# Altium schematic sheet [04] - SIM808.SchDoc: =ProjectName
size A4; CheckedBy: Ven; Author: Ven; CompanyName: HUST; Revision: V.1.0
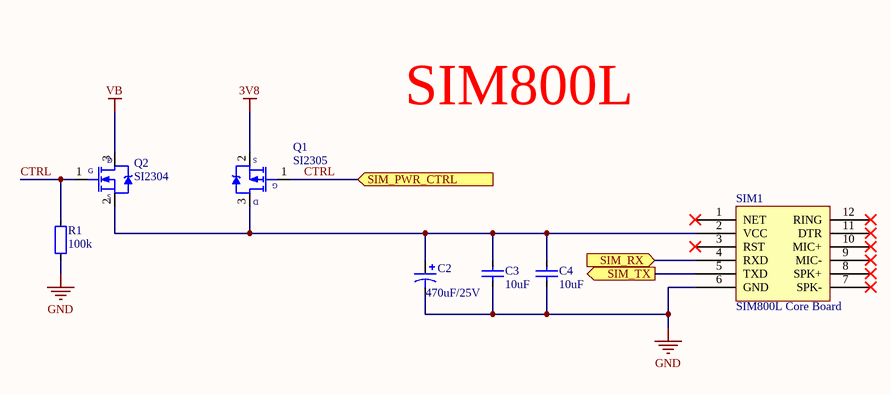
[diagram p0: [04] - SIM808.SchDoc]

## Parts
C2  470uF/25V  [C8mm]
C3  10uF  [CAP_0805]
C4  10uF  [CAP_0805]
Q1  SI2305  [SOT23]
Q2  SI2304  [SOT23]
R1  100k  [RES-SMD-0805]
SIM1  SIM800L Core Board  [SIM800L Core Board]

## Ports
SIM_PWR_CTRL (in), SIM_RX (in), SIM_TX (out)

## Nets
3V8: Q1.2(S)
GND: C2.2 C3.1 C4.1 R1.1 SIM1.6(GND)
VB: Q2.3(D)
CTRL: Q1.1(G) Q2.1(G) R1.2 ; port SIM_PWR_CTRL
SIM_RX: SIM1.4(RXD) ; port SIM_RX
SIM_TX: SIM1.5(TXD) ; port SIM_TX
NetC2_1: C2.1 C3.2 C4.2 Q1.3(D) Q2.2(S) SIM1.2(VCC)

Not connected (* = marked no-connect by the designer): SIM1 1(NET)* 3(RST)* 7(SPK-)* 8(SPK+)* 9(MIC-)* 10(MIC+)* 11(DTR)* 12(RING)*

## Notes on the sheet
- SIM800L
- Project:
- Page Contents:
- Size:
- Date:
- A4
- Checked by:
- Time:
- Revision:
- Sheet
- of
- File:

## Library data of the parts
C2 = Cap Pol: Polarized Capacitor (Axial); Published: 8-Jun-2000; LatestRevisionDate: 17-Jul-2002; LatestRevisionNote: Re-released for DXP Platform.; PackageReference: POLAR0.8; Publisher: Altium Limited
C3 C4 = CapSMD: Capacitor; Value: 33p; Published: 8-Jun-2000; LatestRevisionDate: 17-Jul-2002; LatestRevisionNote: Re-released for DXP Platform.; PackageReference: RAD-0.3; Publisher: Altium Limited
Q1 = SI2305: SI2305 A5SHB P-MOSFET 3.5A 8V SOT-23
Q2 = SI2304: SI2304 A4SHB N-MOSFET 3.6A 30V SOT-23
R1 = Resistor - SMD: Resistor; Manufacturer: Generic Components; Class: Passive; Published: 08/06/2000; Publisher: Altium Hobart Technology Centre